# EAGLE design ll3-b3 (EAGLE 5.10)
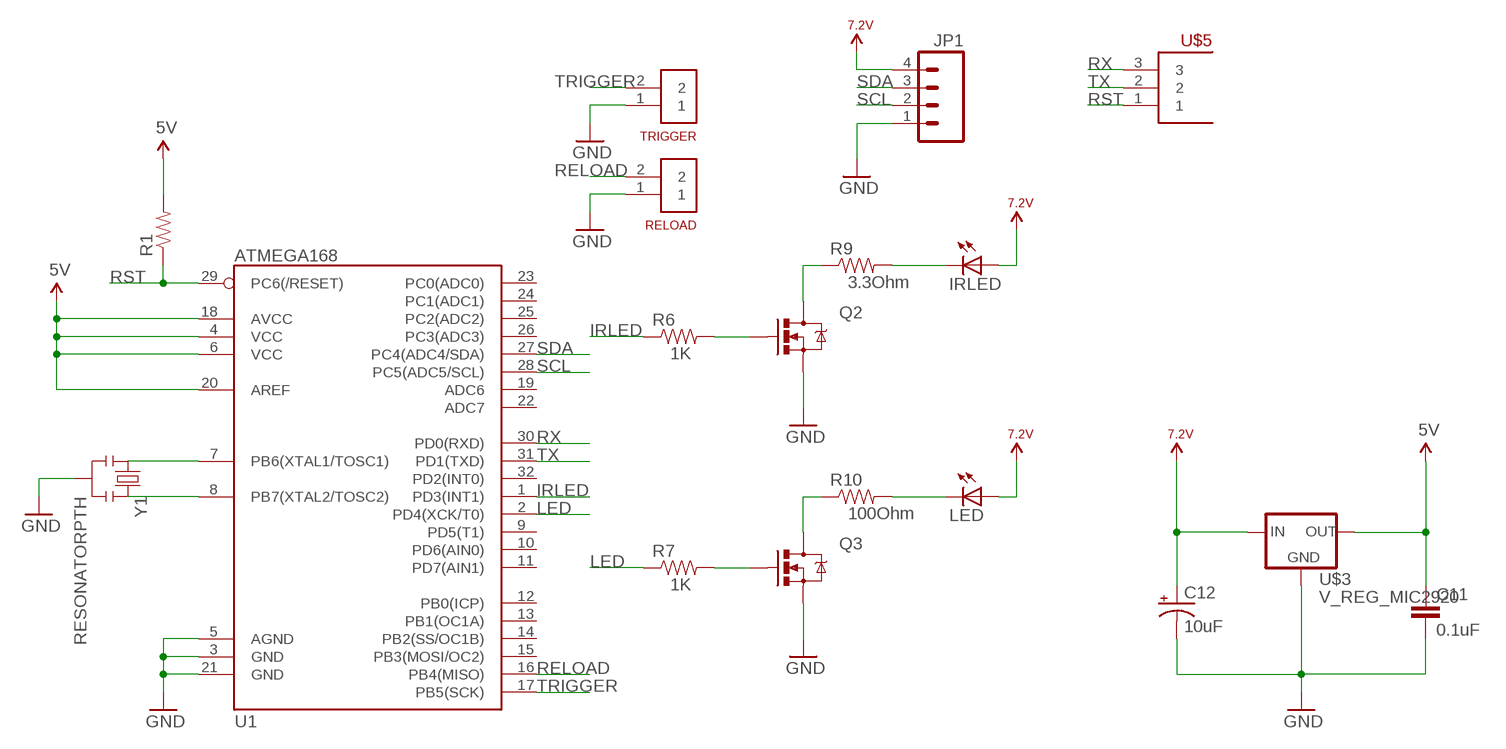
[diagram p0: schematic, sheet 1]

## Parts
C11  0.1uF  CAP0805  [0805]
C12  10uF  CAP_POL1206  [EIA3216]
IRLED  LED5MM  [LED5MM]
JP1  M04LOCK  [1X04_LOCK]
LED  LED5MM  [LED5MM]
Q2  MOSFET-NCHANNELSMD  [SOT23-3]
Q3  MOSFET-NCHANNELSMD  [SOT23-3]
R1  RESISTOR  [0805]
R6  1K  RESISTOR  [0805]
R7  1K  RESISTOR  [0805]
R9  3.3Ohm  RESISTORPTH1  [AXIAL-0.3]
R10  100Ohm  RESISTORPTH1  [AXIAL-0.3]
RELOAD  2HEAD  [2HEAD]
TRIGGER  2HEAD  [2HEAD]
U1  ATMEGA168  [TQFP32-08]
U$3  V_REG_MIC2920  [SOT223]
U$5  3HEAD  [3HEAD]
Y1  RESONATORPTH  [RESONATOR-PTH]

## Nets
5V: C11.1 R1.2 U1.4(VCC) U1.6(VCC) U1.18(AVCC) U1.20(AREF) U$3.3(OUT)
7.2V: C12.A(+) IRLED.A JP1.4 LED.A U$3.1(IN)
GND: C11.2 C12.C(-) JP1.1 Q2.2(S) Q3.2(S) RELOAD.1 TRIGGER.1 U1.3(GND) U1.5(AGND) U1.21(GND) U$3.2(GND) Y1.2
IRLED: R6.1 U1.1(PD3(INT1))
LED: R7.1 U1.2(PD4(XCK/T0))
N$1: U1.7(PB6(XTAL1/TOSC1)) Y1.1
N$2: U1.8(PB7(XTAL2/TOSC2)) Y1.3
N$14: Q2.1(G) R6.2
N$15: Q3.1(G) R7.2
N$16: IRLED.K(C) R9.P$2
N$17: LED.K(C) R10.P$2
N$18: Q3.3(D) R10.P$1
N$20: Q2.3(D) R9.P$1
RELOAD: RELOAD.2 U1.16(PB4(MISO))
RST: R1.1 U1.29(PC6(/RESET)) U$5.1
RX: U1.30(PD0(RXD)) U$5.3
SCL: JP1.2 U1.28(PC5(ADC5/SCL))
SDA: JP1.3 U1.27(PC4(ADC4/SDA))
TRIGGER: TRIGGER.2 U1.17(PB5(SCK))
TX: U1.31(PD1(TXD)) U$5.2
Unconnected: U1.9(PD5(T1)) U1.10(PD6(AIN0)) U1.11(PD7(AIN1)) U1.12(PB0(ICP)) U1.13(PB1(OC1A)) U1.14(PB2(SS/OC1B)) U1.15(PB3(MOSI/OC2)) U1.19(ADC6) U1.22(ADC7) U1.23(PC0(ADC0)) U1.24(PC1(ADC1)) U1.25(PC2(ADC2)) U1.26(PC3(ADC3)) U1.32(PD2(INT0))

## Library data of the parts
C11 = sparkfun:CAP: Capacitor Standard 0603 ceramic capacitor, and 0.1" leaded capacitor.
C12 = sparkfun:CAP_POL: Capacitor Polarized These are standard SMD and PTH capacitors. Normally 10uF, 47uF, and 100uF in electrolytic and tantalum varieties. Always verify the external diameter of the through hole cap, it varies with capacity, voltage, and manufacturer. The EIA devices should be standard.
IRLED LED = sparkfun:LED: LEDs Standard schematic elements and footprints for 5mm, 3mm, 1206, and 0603 sized LEDs. 5mm - Spark Fun Electronics SKU : COM-00529 (and others)
JP1 = sparkfun:M04: Header 4 Standard 4-pin 0.1" header. Use with straight break away headers (SKU : PRT-00116), right angle break away headers (PRT-00553), swiss pins (PRT-00743), machine pins (PRT-00117), and female headers (PRT-00115). Molex polarized connector foot print use with SKU : PRT-08231 with associated crimp pins and housings.
Q2 Q3 = sparkfun:MOSFET-NCHANNEL
R1 R6 R7 R9 R10 = sparkfun:RESISTOR: Resistor Basic schematic elements and footprints for 0603, 1206, and PTH 1/10th watt (small) resistors.
RELOAD TRIGGER = custom:2HEAD
U1 = sparkfun:ATMEGA168
U$3 = sparkfun:V_REG_MIC2920: MIC2920A (http://www.micrel.com/_PDF/mic2920.pdf) - 400mA output LDO Regulator
U$5 = custom:3HEAD
Y1 = sparkfun:RESONATOR: Resonator Small SMD resonator. This is the itty bitty 10/20MHz resonators with built in caps. CSTCE10M0G55 and CSTCE20M0V53. Footprint has been reviewed closely but hasn't been tested yet.

## Board
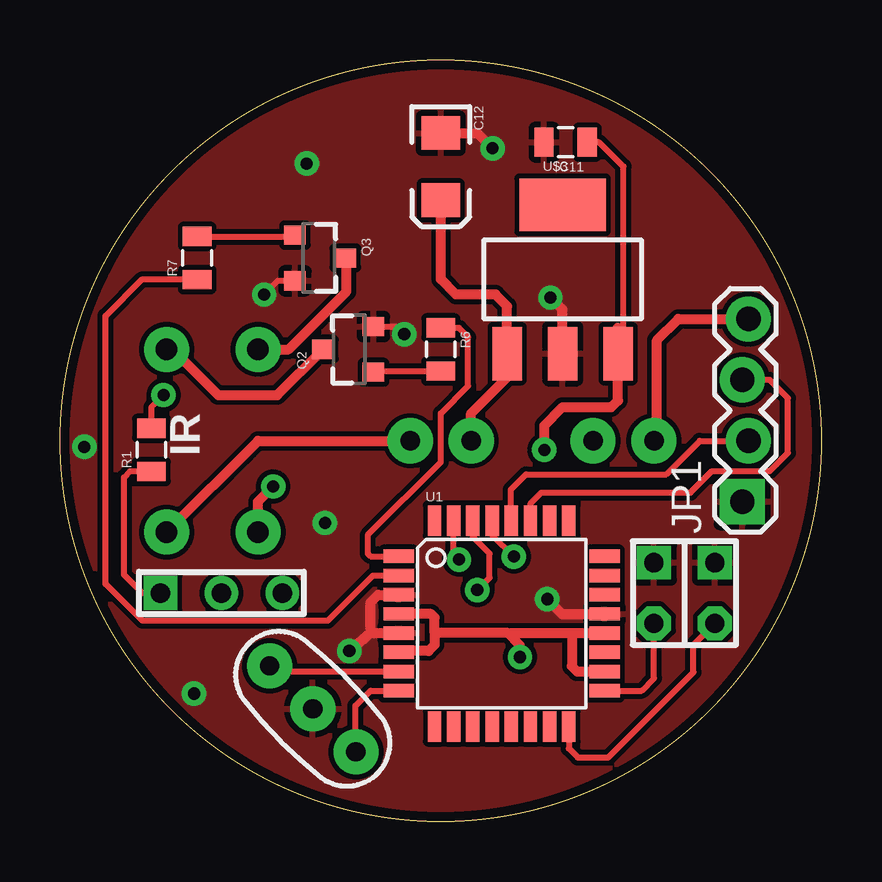
[diagram p1: board, top side]
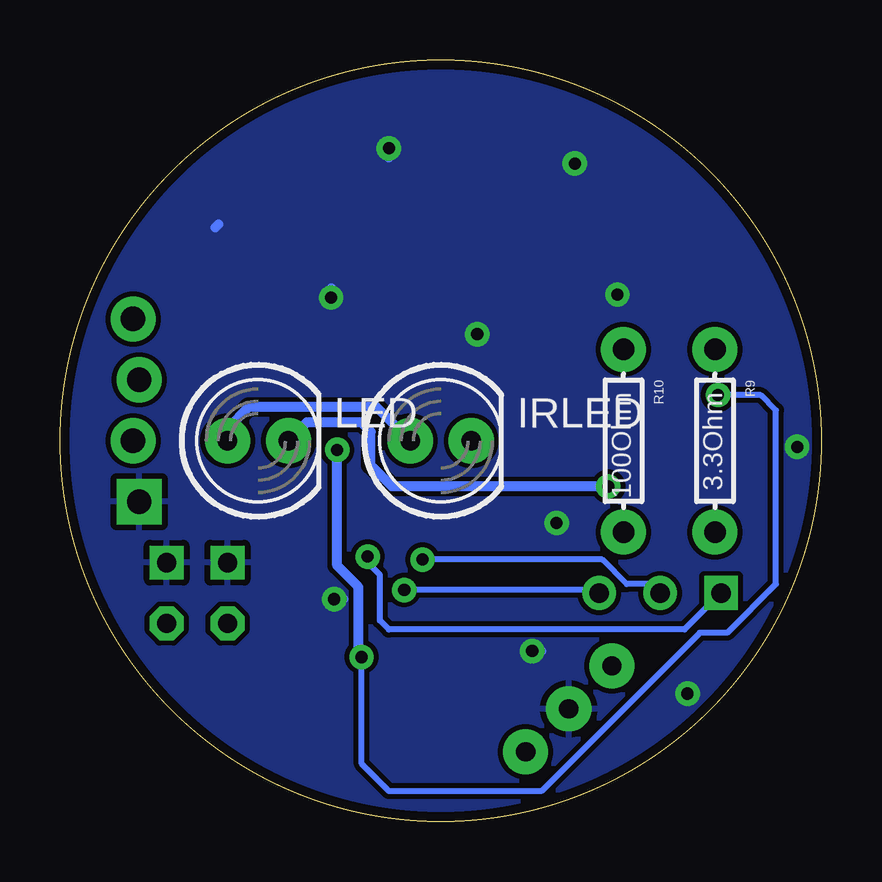
[diagram p2: board, bottom side, seen from below]

Size 31.75 x 31.75 mm. Coordinates in mm from the lower left corner, seen from the top.
Outline: circle at 15.88,15.88 radius 15.88
Copper layers (1*16): Top 0.035mm / dielectric 1.5mm / Bottom 0.035mm
Design rules "SparkFun *": minimum track width 8mil, minimum drill 13mil, track to track 8mil, track to pad 8mil, pad to pad 8mil, via to via 8mil, smd to smd 8mil, copper to edge 15mil, drill to drill 8mil, minimum pad ring 12mil, minimum via ring 10mil, stop-mask expansion 4mil, vias tented up to drill 25mil, thermal gap 10mil

### Footprints (pad centres in the part's own frame; a part is rotated, then mirrored left to right if it is on the bottom)
0805 = smd 0.8 x 1.2: 1 -0.9,0; 2 0.9,0
EIA3216 = smd 1.4 x 1.6: A 1.4,0; C -1.4,0
LED5MM = drill 0.813 pad 1.88 round: A -1.27,0; K 1.27,0
1X04_LOCK = drill 1.016 pad 1.88 square: 1 0,0.127 | drill 1.016 pad 1.88 round: 2 2.54,-0.127; 3 5.08,0.127; 4 7.62,-0.127
SOT23-3 = smd 0.8 x 0.9: 1 -0.95,-1; 2 0.95,-1; 3 0,1.1
AXIAL-0.3 = drill 0.9 pad 1.88 round: P$1 -3.81,0; P$2 3.81,0
2HEAD = drill 0.8 square: 1 -1.27,0 | drill 0.8 octagon: 2 1.27,0
TQFP32-08 = smd 1.27 x 0.559: 1 -4.293,2.8; 2 -4.293,2; 3 -4.293,1.2; 4 -4.293,0.4; 5 -4.293,-0.4; 6 -4.293,-1.2; 7 -4.293,-2; 8 -4.293,-2.8; 17 4.293,-2.8; 18 4.293,-2; 19 4.293,-1.2; 20 4.293,-0.4; 21 4.293,0.4; 22 4.293,1.2; 23 4.293,2; 24 4.293,2.8 | smd 0.559 x 1.27: 9 -2.8,-4.293; 10 -2,-4.293; 11 -1.2,-4.293; 12 -0.4,-4.293; 13 0.4,-4.293; 14 1.2,-4.293; 15 2,-4.293; 16 2.8,-4.293; 25 2.8,4.293; 26 2,4.293; 27 1.2,4.293; 28 0.4,4.293; 29 -0.4,4.293; 30 -1.2,4.293; 31 -2,4.293; 32 -2.8,4.293
SOT223 = smd 1.219 x 2.235: 1 -2.311,-3.099; 2 0,-3.099; 3 2.311,-3.099 | smd 3.6 x 2.2: 4 0,3.099
3HEAD = drill 0.8 square: 1 -2.54,0 | drill 0.8 round: 2 0,0; 3 2.54,0
RESONATOR-PTH = drill 0.8 pad 1.88 round: 1 -2.54,0; 2 0,0; 3 2.54,0

### Placement (x,y rotation side)
C11  21.08,28.32 180 top
C12  15.88,27.3 270 top
IRLED  15.88,15.88 0 bottom
JP1  28.57,13.33 90 top
LED  23.49,15.88 0 bottom
Q2  12.06,19.68 90 top
Q3  10.79,23.49 270 top
R1  3.81,15.49 90 top
R6  15.88,19.68 270 top
R7  5.71,23.49 90 top
R9  4.44,15.88 270 bottom
R10  8.25,15.88 270 bottom
RELOAD  27.3,9.52 270 top
TRIGGER  24.77,9.52 270 top
U1  18.41,8.25 0 top
U$3  20.95,22.61 0 top
U$5  6.73,9.52 0 top
Y1  10.54,4.7 315 top

### Tracks (layer width: path | path; a pad name or v marks a point on that pad's centre or on a via)
5V  (via drill 0.51)
  Top 0.254: R1.2 3.81,17.27 v4.32,17.78 | C11.1 22.48,28.32 23.49,27.3 23.49,19.74 U$3.3
  Top 0.406: U1.4 15.47,8.65 15.62,8.51 15.62,7.87 | 15.62,7.87 15.62,7.37 15.37,7.11 14.18,7.11 U1.6 | 18.67,7.85 15.64,7.85 15.62,7.87 | 18.67,7.85 21.34,7.85 | 21.34,7.85 U1.20 | U1.18 21.56,6.25 21.34,6.48 21.34,7.85 | v20.19,15.49 20.19,16.51 20.95,17.27 22.99,17.27 23.27,17.55 U$3.3 23.24,19.53 23.24,20.57 | v19.18,6.86 19.18,7.35 18.67,7.85
  Bottom 0.254: 18.92,7.11 v19.18,6.86 19.18,2.41 18.03,1.27 11.68,1.27 5.08,7.87 3.94,7.87 1.9,9.91 1.9,17.14 2.54,17.78 v4.32,17.78
  Bottom 0.406: v20.19,15.49 20.19,10.67 19.3,9.78 19.3,6.98 v19.18,6.86
7.2V
  Top 0.406: U$3.1 18.54,19.41 | U$3.1 18.64,18.52 17.14,17.02 IRLED.A | U$3.1 18.64,21.49 18.16,21.97 16.51,21.97 15.88,22.61 C12.A | JP1.4 25.78,20.95 24.89,20.07 24.89,16 LED.A
  Bottom 0.406: LED.A 24.77,16.38 23.88,17.27 18.54,17.27 IRLED.A
GND  (via drill 0.51)
  Top 0.254: Q2.2 14.04,20.63 v14.35,20.32 | Q3.2 9.08,22.54 v8.51,21.97
  Top 0.406: U1.3 13.26,9.45 12.95,9.14 12.95,8 13.08,7.87 | 13.08,7.87 14.1,7.87 U1.5 | U1.21 20.94,8.65 v20.32,9.27 | U$3.2 20.95,21.34 v20.45,21.84 | C12.C 17.4,28.7 v18.03,28.07 | 13.08,7.87 12.95,7.87 v12.06,7.11
  Bottom 0.254: v14.35,20.32 14.35,20.07 | v8.51,21.97 8.51,21.59
  Bottom 0.406: v20.32,9.27 19.94,9.27 | v20.45,21.84 20.45,22.22 | 25.27,24.76 25.15,24.89 | v18.03,28.07 18.03,27.69 | v12.06,7.11 11.81,6.98 11.68,7.11
  other vias: 5.59,5.33 10.29,27.43 11.05,12.45 1.02,15.62
  pour Bottom: 32.38,32.39 -1.91,32.39 -1.91,-0.64 31.12,-0.64
  pour Top: -1.91,-0.64 33.66,-0.64 33.66,32.39 -1.91,32.39
IRLED
  Top 0.254: U1.1 12.95,11.05 12.83,11.18 12.83,11.94 15.88,14.99 15.88,17.02 17.02,18.16 17.02,20.19 16.64,20.57 15.89,20.57 R6.1
LED
  Top 0.254: U1.2 13.05,10.25 11.18,8.38 3.43,8.38 1.9,9.91 1.9,21.08 3.43,22.61 R7.1
N$1
  Top 0.254: U1.7 8.98,6.25 Y1.1
N$2
  Top 0.254: U1.8 12.95,5.45 12.32,4.83 12.32,2.92 Y1.3
N$14
  Top 0.254: R6.2 13.11,18.79 Q2.1
N$15
  Top 0.254: R7.2 9.74,24.39 Q3.1
N$16
  Top 0.406: IRLED.K 8.25,15.88 R9.P$2
N$17  (via drill 0.51)
  Top 0.406: R10.P$2 8.25,13.33 v8.89,13.97
  Bottom 0.406: v8.89,13.97 17.91,13.97 18.8,14.86 18.8,16.26 19.18,16.64 21.46,16.64 LED.K
N$18
  Top 0.406: 11.89,23.32 Q3.3 11.94,23.45 11.94,22.1 9.52,19.68 R10.P$1
N$20
  Top 0.406: R9.P$1 4.7,19.68 6.6,17.78 9.06,17.78 Q2.3
RELOAD
  Top 0.254: U1.16 21.21,3.04 21.59,2.67 22.86,2.67 26.42,6.22 26.42,7.37 RELOAD.2
RST  (via drill 0.51)
  Top 0.254: U$5.1 3.43,9.52 2.67,10.29 2.67,14.35 2.92,14.6 R1.1 | U1.29 18.02,11.96 v18.92,11.05
  Bottom 0.254: v18.92,11.05 18.92,10.79 18.41,10.29 18.41,8.38 18.03,8 5.71,8 U$5.1
RX  (via drill 0.51)
  Top 0.254: U1.30 17.21,11.87 17.91,11.18 17.91,10.16 v17.4,9.65
  Bottom 0.254: v17.4,9.65 9.4,9.65 U$5.3
SCL
  Top 0.254: JP1.2 26.67,15.88 25.27,14.48 19.43,14.48 18.8,13.84 18.8,12.57 U1.28
SDA
  Top 0.254: U1.27 19.61,13.26 20.07,13.72 26.29,13.72 27.18,14.6 29.59,14.6 30.35,15.37 30.35,17.65 29.59,18.41 JP1.3
TRIGGER
  Top 0.254: U1.17 24.25,5.45 24.77,5.97 TRIGGER.2
TX  (via drill 0.51)
  Top 0.254: U1.31 16.41,11.14 v16.64,10.92
  Bottom 0.254: v16.64,10.92 9.14,10.92 8.13,9.91 7.11,9.91 U$5.2

### Text on the board
tPlace: IR